# Altium schematic sheet uC.SchDoc
size Legal
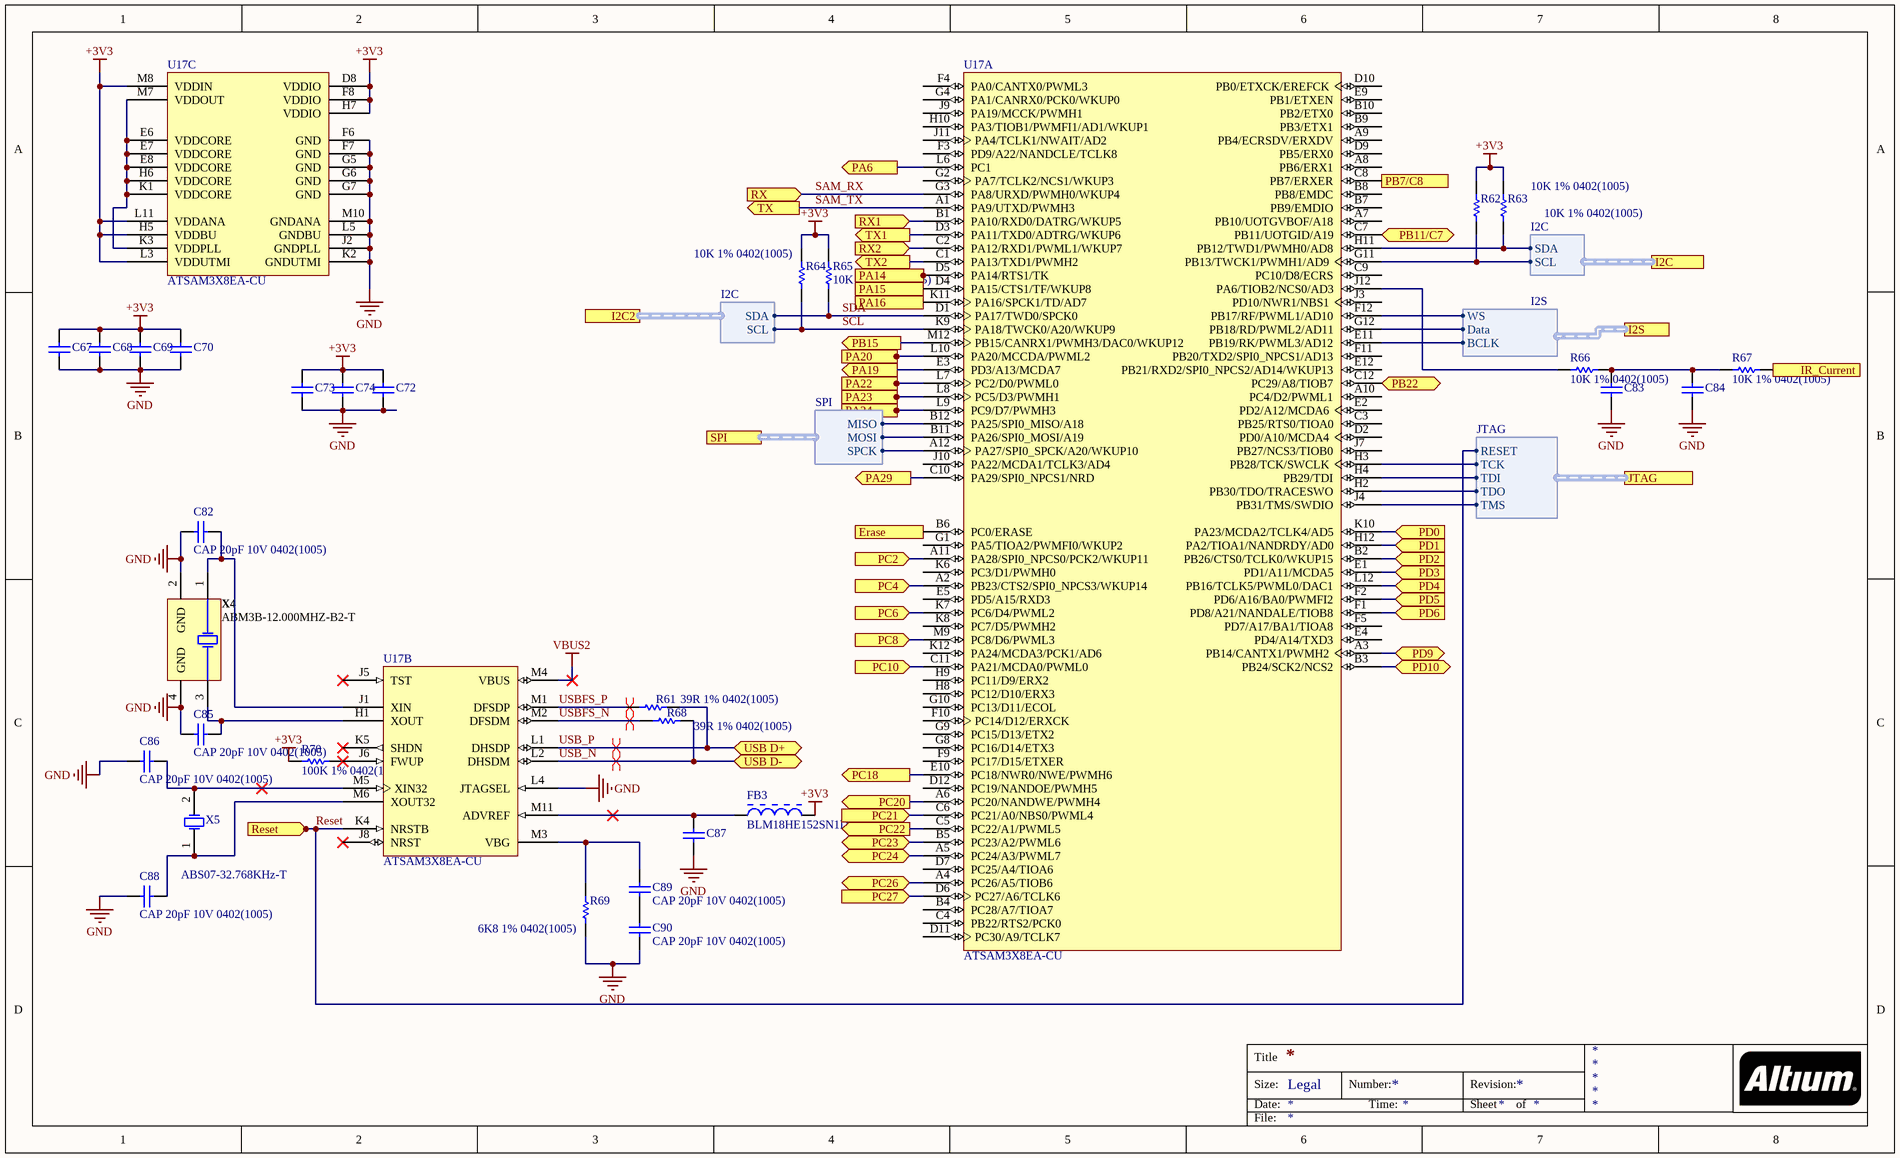
[diagram p0: uC.SchDoc]

## Parts
C67  CAP 100nF 10V 0402(1005)  [CAPC0402(1005)60_L]  (value not drawn)
C68  CAP 100nF 10V 0402(1005)  [CAPC0402(1005)60_L]  (value not drawn)
C69  CAP 100nF 10V 0402(1005)  [CAPC0402(1005)60_L]  (value not drawn)
C70  CAP 100nF 10V 0402(1005)  [CAPC0402(1005)60_L]  (value not drawn)
C72  CAP 100nF 10V 0402(1005)  [CAPC0402(1005)60_L]  (value not drawn)
C73  CAP 100nF 10V 0402(1005)  [CAPC0402(1005)60_L]  (value not drawn)
C74  CAP 100nF 10V 0402(1005)  [CAPC0402(1005)60_L]  (value not drawn)
C82  CAP 20pF 10V 0402(1005)  [CAPC0402(1005)60_L]
C83  CAP 100nF 10V 0402(1005)  [CAPC0402(1005)60_L]  (value not drawn)
C84  CAP 100nF 10V 0402(1005)  [CAPC0402(1005)60_L]  (value not drawn)
C85  CAP 20pF 10V 0402(1005)  [CAPC0402(1005)60_L]
C86  CAP 20pF 10V 0402(1005)  [CAPC0402(1005)60_L]
C87  CAP 100nF 10V 0402(1005)  [CAPC0402(1005)60_L]  (value not drawn)
C88  CAP 20pF 10V 0402(1005)  [CAPC0402(1005)60_L]
C89  CAP 20pF 10V 0402(1005)  [CAPC0402(1005)60_L]
C90  CAP 20pF 10V 0402(1005)  [CAPC0402(1005)60_L]
FB3  BLM18HE152SN1D  [MURA-BLM18-RF-H4-CHIP-2_V]
R61  39R 1% 0402(1005)  [RESC0402(1005)_L]
R62  10K 1% 0402(1005)  [RESC0402(1005)_L]
R63  10K 1% 0402(1005)  [RESC0402(1005)_L]
R64  10K 1% 0402(1005)  [RESC0402(1005)_L]
R65  10K 1% 0402(1005)  [RESC0402(1005)_L]
R66  10K 1% 0402(1005)  [RESC0402(1005)_L]
R67  10K 1% 0402(1005)  [RESC0402(1005)_L]
R68  39R 1% 0402(1005)  [RESC0402(1005)_L]
R69  6K8 1% 0402(1005)  [RESC0402(1005)_L]
R70  100K 1% 0402(1005)  [RESC0402(1005)_L]
U17  ATSAM3X8EA-CU  [LFBGA144]  (parts A,B,C of 3)
X4  ABM3B-12.000MHZ-B2-T  [ABRA-ABM3B-4_V]
X5  ABS07-32.768KHz-T  [ABRA-ABS07-2_V]

## Ports
Erase (in), I2C2 (harness I2C), I2C (harness I2C), I2S (harness I2S), IR_Current (out), JTAG (harness JTAG), PA6 (out), PA14 (out), PA15 (out), PA16 (in), PA19 (out), PA20 (in), PA22 (out), PA23 (out), PA24 (out), PA29 (out), PB7/C8 (in), PB11/C7 (bidir), PB15 (out), PB22 (bidir), PC2 (in), PC4 (in), PC6 (in), PC8 (in), PC10 (in), PC18 (out), PC20 (out), PC21 (in), PC22 (out), PC23 (bidir), PC24 (bidir), PC26 (bidir), PC27 (in), PD0 (in), PD1 (in), PD2 (in), PD3 (in), PD4 (in), PD5 (in), PD6 (in), PD9 (bidir), PD10 (bidir), Reset (in), RX1 (in), RX2 (in), RX (in), SPI (harness SPI), TX1 (out), TX2 (out), TX (out), USB D+ (bidir), USB D- (bidir)

## Harnesses
I2C: SCL, SDA
I2S: WS, BCLK, Data
SPI: MISO, MOSI, SPCK
JTAG: RESET, TCK, TDI, TDO, TMS

## Nets
+3V3: C67.2 C68.2 C69.2 C70.2 C72.2 C73.2 C74.2 FB3.2 R62.2 R63.2 R64.2 R65.2 R70.1 U17.D8(VDDIO) U17.F8(VDDIO) U17.H5(VDDBU) U17.H7(VDDIO) U17.L3(VDDUTMI) U17.L11(VDDANA) U17.M8(VDDIN)
GND: C67.1 C68.1 C69.1 C70.1 C72.1 C73.1 C74.1 C82.1 C83.1 C84.1 C85.1 C86.1 C87.1 C88.1 C90.2 R69.2 U17.F6(GND) U17.F7(GND) U17.G5(GND) U17.G6(GND) U17.G7(GND) U17.J2(GNDPLL) U17.K2(GNDUTMI) U17.L4(JTAGSEL) U17.L5(GNDBU) U17.M10(GNDANA) X4.2(GND) X4.4(GND)
VBUS2: U17.M4(VBUS)
Erase: U17.B6(PC0/ERASE) ; port Erase
IR_Current: R67.2 ; port IR_Current
PA6: U17.L6(PC1) ; port PA6
PA14: U17.D5(PA14/RTS1/TK) ; port PA14
PA15: U17.D4(PA15/CTS1/TF/WKUP8) ; port PA15
PA16: U17.K11(PA16/SPCK1/TD/AD7) ; port PA16
PA19: U17.E3(PD3/A13/MCDA7) ; port PA19
PA20: U17.L10(PA20/MCCDA/PWML2) ; port PA20
PA22: U17.L7(PC2/D0/PWML0) ; port PA22
PA23: U17.L8(PC5/D3/PWMH1) ; port PA23
PA24: U17.L9(PC9/D7/PWMH3) ; port PA24
PA29: U17.C10(PA29/SPI0_NPCS1/NRD) ; port PA29
PB7/C8: U17.C8(PB7/ERXER) ; port PB7/C8
PB11/C7: U17.C7(PB11/UOTGID/A19) ; port PB11/C7
PB15: U17.M12(PB15/CANRX1/PWMH3/DAC0/WKUP12) ; port PB15
PB22: U17.C12(PC29/A8/TIOB7) ; port PB22
PC2: U17.A11(PA28/SPI0_NPCS0/PCK2/WKUP11) ; port PC2
PC4: U17.A2(PB23/CTS2/SPI0_NPCS3/WKUP14) ; port PC4
PC6: U17.K7(PC6/D4/PWML2) ; port PC6
PC8: U17.M9(PC8/D6/PWML3) ; port PC8
PC10: U17.C11(PA21/MCDA0/PWML0) ; port PC10
PC18: U17.E10(PC18/NWR0/NWE/PWMH6) ; port PC18
PC20: U17.A6(PC20/NANDWE/PWMH4) ; port PC20
PC21: U17.C6(PC21/A0/NBS0/PWML4) ; port PC21
PC22: U17.C5(PC22/A1/PWML5) ; port PC22
PC23: U17.B5(PC23/A2/PWML6) ; port PC23
PC24: U17.A5(PC24/A3/PWML7) ; port PC24
PC26: U17.A4(PC26/A5/TIOB6) ; port PC26
PC27: U17.D6(PC27/A6/TCLK6) ; port PC27
PD0: U17.K10(PA23/MCDA2/TCLK4/AD5) ; port PD0
PD1: U17.H12(PA2/TIOA1/NANDRDY/AD0) ; port PD1
PD2: U17.B2(PB26/CTS0/TCLK0/WKUP15) ; port PD2
PD3: U17.E1(PD1/A11/MCDA5) ; port PD3
PD4: U17.L12(PB16/TCLK5/PWML0/DAC1) ; port PD4
PD5: U17.F2(PD6/A16/BA0/PWMFI2) ; port PD5
PD6: U17.F1(PD8/A21/NANDALE/TIOB8) ; port PD6
PD9: U17.A3(PB14/CANTX1/PWMH2) ; port PD9
PD10: U17.B3(PB24/SCK2/NCS2) ; port PD10
Reset: U17.K4(NRSTB) ; port Reset, port JTAG.RESET
RX1: U17.B1(PA10/RXD0/DATRG/WKUP5) ; port RX1
RX2: U17.C2(PA12/RXD1/PWML1/WKUP7) ; port RX2
SAM_RX: U17.G3(PA8/URXD/PWMH0/WKUP4) ; port RX
SAM_TX: U17.A1(PA9/UTXD/PWMH3) ; port TX
SCL: R64.1 U17.K9(PA18/TWCK0/A20/WKUP9) ; port I2C2.SCL
SDA: R65.1 U17.D1(PA17/TWD0/SPCK0) ; port I2C2.SDA
TX1: U17.D3(PA11/TXD0/ADTRG/WKUP6) ; port TX1
TX2: U17.C1(PA13/TXD1/PWMH2) ; port TX2
USB_N: R68.2 U17.L2(DHSDM) ; port USB D-
USB_P: R61.2 U17.L1(DHSDP) ; port USB D+
USBFS_N: R68.1 U17.M2(DFSDM)
USBFS_P: R61.1 U17.M1(DFSDP)
NetC82_2: C82.2 U17.J1(XIN) X4.1(X1)
NetC83_2: C83.2 C84.2 R66.2 R67.1
NetC85_2: C85.2 U17.H1(XOUT) X4.3(X2)
NetC86_2: C86.2 U17.M5(XIN32) X5.2(X2)
NetC87_2: C87.2 FB3.1 U17.M11(ADVREF)
NetC88_2: C88.2 U17.M6(XOUT32) X5.1(X1)
NetC89_1: C89.1 R69.1 U17.M3(VBG)
NetC89_2: C89.2 C90.1
NetR62_1: R62.1 U17.G11(PB13/TWCK1/PWMH1/AD9) ; port I2C.SCL
NetR63_1: R63.1 U17.H11(PB12/TWD1/PWMH0/AD8) ; port I2C.SDA
NetR66_1: R66.1 U17.J12(PA6/TIOB2/NCS0/AD3)
NetR70_2: R70.2 U17.J6(FWUP)
NetU17_A12: U17.A12(PA27/SPI0_SPCK/A20/WKUP10) ; port SPI.SPCK
NetU17_B11: U17.B11(PA26/SPI0_MOSI/A19) ; port SPI.MOSI
NetU17_B12: U17.B12(PA25/SPI0_MISO/A18) ; port SPI.MISO
NetU17_E6: U17.E6(VDDCORE) U17.E7(VDDCORE) U17.E8(VDDCORE) U17.H6(VDDCORE) U17.K1(VDDCORE) U17.K3(VDDPLL) U17.M7(VDDOUT)
NetU17_E11: U17.E11(PB19/RK/PWML3/AD12) ; port I2S.BCLK
NetU17_F12: U17.F12(PB17/RF/PWML1/AD10) ; port I2S.WS
NetU17_G12: U17.G12(PB18/RD/PWML2/AD11) ; port I2S.Data
NetU17_H2: U17.H2(PB30/TDO/TRACESWO) ; port JTAG.TDO
NetU17_H3: U17.H3(PB28/TCK/SWCLK) ; port JTAG.TCK
NetU17_H4: U17.H4(PB29/TDI) ; port JTAG.TDI
NetU17_J4: U17.J4(PB31/TMS/SWDIO) ; port JTAG.TMS

Not connected (* = marked no-connect by the designer): U17 A7(PB10/UOTGVBOF/A18) A8(PB6/ERX1) A9(PB4/ECRSDV/ERXDV) A10(PC4/D2/PWML1) B4(PC28/A7/TIOA7) B7(PB9/EMDIO) B8(PB8/EMDC) B9(PB3/ETX1) B10(PB2/ETX0) C3(PB25/RTS0/TIOA0) C4(PB22/RTS2/PCK0) C9(PC10/D8/ECRS) D2(PD0/A10/MCDA4) D7(PC25/A4/TIOA6) D9(PB5/ERX0) D10(PB0/ETXCK/EREFCK) D11(PC30/A9/TCLK7) D12(PC19/NANDOE/PWMH5) E2(PD2/A12/MCDA6) E4(PD4/A14/TXD3) E5(PD5/A15/RXD3) E9(PB1/ETXEN) E12(PB21/RXD2/SPI0_NPCS2/AD14/WKUP13) F3(PD9/A22/NANDCLE/TCLK8) F4(PA0/CANTX0/PWML3) F5(PD7/A17/BA1/TIOA8) F9(PC17/D15/ETXER) F10(PC14/D12/ERXCK) F11(PB20/TXD2/SPI0_NPCS1/AD13) G1(PA5/TIOA2/PWMFI0/WKUP2) G2(PA7/TCLK2/NCS1/WKUP3) G4(PA1/CANRX0/PCK0/WKUP0) G8(PC16/D14/ETX3) G9(PC15/D13/ETX2) G10(PC13/D11/ECOL) H8(PC12/D10/ERX3) H9(PC11/D9/ERX2) H10(PA3/TIOB1/PWMFI1/AD1/WKUP1) J3(PD10/NWR1/NBS1) J5(TST)* J7(PB27/NCS3/TIOB0) J8(NRST)* J9(PA19/MCCK/PWMH1) J10(PA22/MCDA1/TCLK3/AD4) J11(PA4/TCLK1/NWAIT/AD2) K5(SHDN)* K6(PC3/D1/PWMH0) K8(PC7/D5/PWMH2) K12(PA24/MCDA3/PCK1/AD6)

## Layout directives
differential pair: USB_N, USB_P, USBFS_N, USBFS_P

## Notes on the sheet
- Title
- Size:
- Date:
- Legal
- Number:
- Time:
- Revision:
- Sheet
- of
- File:

## Library data of the parts
C67-C70 C72-C74 C83 C84 C87 = CMP-1034-02066-1: CAP 100nF 10V ±20% 0402 (1005 Metric) Thickness 0.6mm SMD; Tolerance: Â±20%; Case-Metric: 1005; Case-EIA: 0402; Max Thickness: 0.6 mm; Rated Voltage: 10 V; Technology: SMT; Value: 100nF
C82 C85 C86 C88-C90 = CMP-1034-00874-1: CAP 20pF 10V ±5% 0402 (1005 Metric) Thickness 0.6mm SMD; Case-EIA: 0402; Tolerance: Â±5%; Case-Metric: 1005; Value: 20pF; Rated Voltage: 10 V; Technology: SMT; Max Thickness: 0.6 mm
FB3 = CMP-0686-00368-2: Chip Ferrite Bead for GHz Band High-speed Signal Lines, 1500 Ohm, 500 mA, -55 to 125 degC, 1.6 x 0.8 x 0.95 mm SMD, Tape and Reel; Manufacturer: Murata; Rated Current: 500 mA; Impedance (at 100 MHz): 1500 Ohm +/- 25%; DC Resistance: 0.50 Ohm Max.; Packing: Tape and Reel; DatasheetVersion: 08/2013; ComponentLink1URL: http://www.murata.com/; Mounting Technology: Surface Mount; ComponentLink2URL: http://www.murata.com/products/catalog/pdf/c31e.pdf; ComponentLink3Description: Package Specification; ComponentLink2Description: Datasheet; PackageReference: BLM18_H950-2; ComponentLink1Description: Manufacturer URL; PackageDescription: 2-Pin Chip, Body 1.6 x 0.8 mm; ComponentLink3URL: http://www.murata.com/products/catalog/pdf/c31e.pdf; PartNumber: BLM18HE152SN1D; Operating Temperature Range: -55 to 125 degC
R61 R68 = CMP-1011-00350-1: 39R 0.063W 1% 0402 (1005 Metric)  SMD; Case-EIA: 0402; Value: 39.00 Ohm; Case-Metric: 1005; Tolerance: 1 %; Power: 0.063 W; Technology: SMT
R62-R67 = CMP-1011-00623-1: 10K 0.063W 1% 0402 (1005 Metric)  SMD; Case-EIA: 0402; Value: 10000.00 Ohm; Case-Metric: 1005; Technology: SMT; Tolerance: 1 %; Power: 0.063 W
R69 = CMP-1011-00604-1: 6K8 0.063W 1% 0402 (1005 Metric)  SMD; Value: 6800.00 Ohm; Case-Metric: 1005; Case-EIA: 0402; Technology: SMT; Tolerance: 1 %; Power: 0.063 W
R70 = CMP-1011-00736-1: 100K 0.063W 1% 0402 (1005 Metric)  SMD; Value: 100000.00 Ohm; Case-Metric: 1005; Case-EIA: 0402; Power: 0.063 W; Tolerance: 1 %; Technology: SMT
U17 = CMP-0076-00181-1: SAM3X ARM Cortex-M3 Flash-based Microcontroller, 512 KB Flash, 96 KB SRAM, 103 User I/Os, 1.62 to 3.6 V, -40 to 85 degC, 144-Pin LFBGA, RoHS; Manufacturer: Atmel; Max. Operating Freq.: 84 MHz; ADC Channels: 16; Max I/O Pins: 103; CAN: 2; # of Touch Channels: 32; ADC Resolution: 12 bits; SPI: 4; Flash: 512 Kbytes; UART: 5; SRAM: 96 Kbytes; ComponentLink1URL: http://www.atmel.com/; Mounting Technology: Surface Mount; ComponentLink3URL: http://www.atmel.com/Images/doc11057.pdf; Operating Voltage: 1.62 to 3.6 V; ComponentLink1Description: Manufacturer URL; PackageReference: LFBGA-144; ComponentLink2URL: http://www.atmel.com/Images/doc11057.pdf; Temp. Range: -40 to 85 degC; RoHS: TRUE; ComponentLink2Description: Datasheet; DAC Channels: 2; PackageDescription: 144-Ball Ball Grid Array, Body 10 x 10 mm, Pitch 0.8 mm; PackageVersion: 11057B; PartNumber: ATSAM3X8EA-CU; ComponentLink3Description: Package Specification; DatasheetVersion: 11057B; PartId: 2
X4 = CMP-1688-00007-1: Ceramic SMD Crystal, 12 MHz, +/- 20 ppm, 70 Ohm, -20 to 70 degC, 4-Pin SMD, RoHS, Tape and Reel; Case\Package: TO-263-4; Outputs: 1; Max Input Voltage: 25 V; Dropout Voltage: 2 V; Max Ouput Current: 1.5 A; Nominal Output Voltage: 5 V; Min Input Voltage: 7 V; Mount: Surface Mount; ComponentLink2Description: Datasheet; DatasheetVersion: Aug-15; PackageReference: ABM3B; Radiation Hardening: No; Weight: 0.050897 oz; ComponentLink1URL: http://www.abracon.com/; RoHSCompliant: true; Max Operating Temperature: 125 degC; PackageDescription: 4-Pin Surface Mount Device, Body 5 x 3.2 mm; ComponentLink1Description: Manufacturer URL; Package Quantity: 500; Output Voltage: 5 V; ComponentLink2URL: http://www.abracon.com/Resonators/abm3b.pdf; Min Operating Temperature: 0 degC; Output Current: 1.5 A; Packaging: Tape and Reel; Pins: 3; REACH SVHC: No SVHC
X5 = CMP-0447-00001-2: Crystal, 32.768 kHz, 12.5 pF, -40 to 85 degC, SMD Low Profile 3.2 x 1.5 x 0.9 mm, Tape and Reel; Manufacturer: Abracon; Q Value (Type): 30000; Operation Mode: Flexural Mode (Tuning Fork); Shunt Capacitance (C0): 0.9 to 1.2 pF; Load Capacitance (CL): 12.5 pF; Frequency Tolerance @+25degC: +/- 20 ppm; Drive Level (Type): 0.1 uW; Equivalent Series Resistance (R1): 70 Kohm; Insulation Resistance (Min): 500 Mohm; ComponentLink3URL: http://www.abracon.com/Resonators/ABS07.pdf; PackageDescription: 2-Pin Hand Drawn, Body 3.2x1.5mm, Pitch 2.5mm; Operating Temperature: -40 to 85 degC; ComponentLink2URL: http://www.abracon.com/Resonators/ABS07.pdf; PackageReference: ABS07-2; ComponentLink3Description: Package Specification; ComponentLink1Description: Manufacturer URL; DatasheetVersion: 04.03.13; Mounting Technology: Surface Mount; ComponentLink2Description: Datasheet; ComponentLink1URL: http://www.abracon.com/; PartNumber: ABS07-32.768KHz-T; Packing: Tape and Reel; Frequency: 32.768 kHz